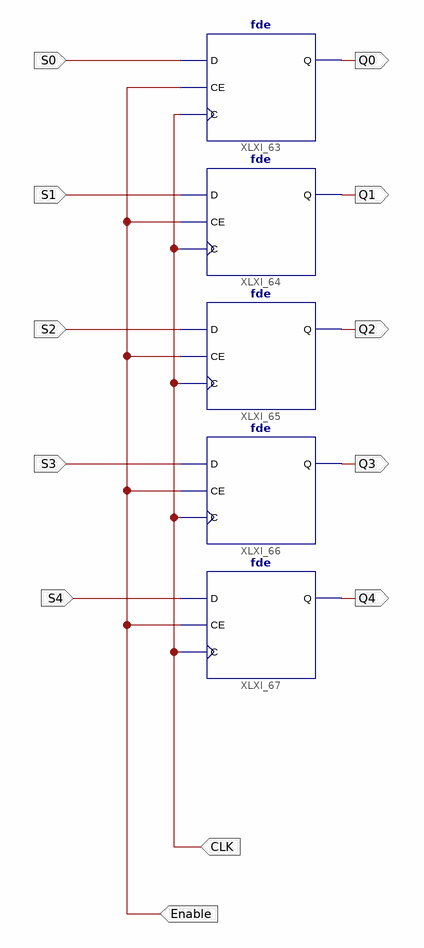
[diagram p0: schematic sheet 1]
// Xilinx ISE schematic Register5Bit.sch (spartan3e) as structural Verilog: 5 symbols, 12 ports
module Register5Bit (
  input  CLK,
  input  Enable,
  input  S0,
  input  S1,
  input  S2,
  input  S3,
  input  S4,
  output Q4,
  output Q0,
  output Q1,
  output Q2,
  output Q3
);

  fde XLXI_63 (.C(CLK), .CE(Enable), .D(S0), .Q(Q0));
  fde XLXI_64 (.C(CLK), .CE(Enable), .D(S1), .Q(Q1));
  fde XLXI_65 (.C(CLK), .CE(Enable), .D(S2), .Q(Q2));
  fde XLXI_66 (.C(CLK), .CE(Enable), .D(S3), .Q(Q3));
  fde XLXI_67 (.C(CLK), .CE(Enable), .D(S4), .Q(Q4));
endmodule
